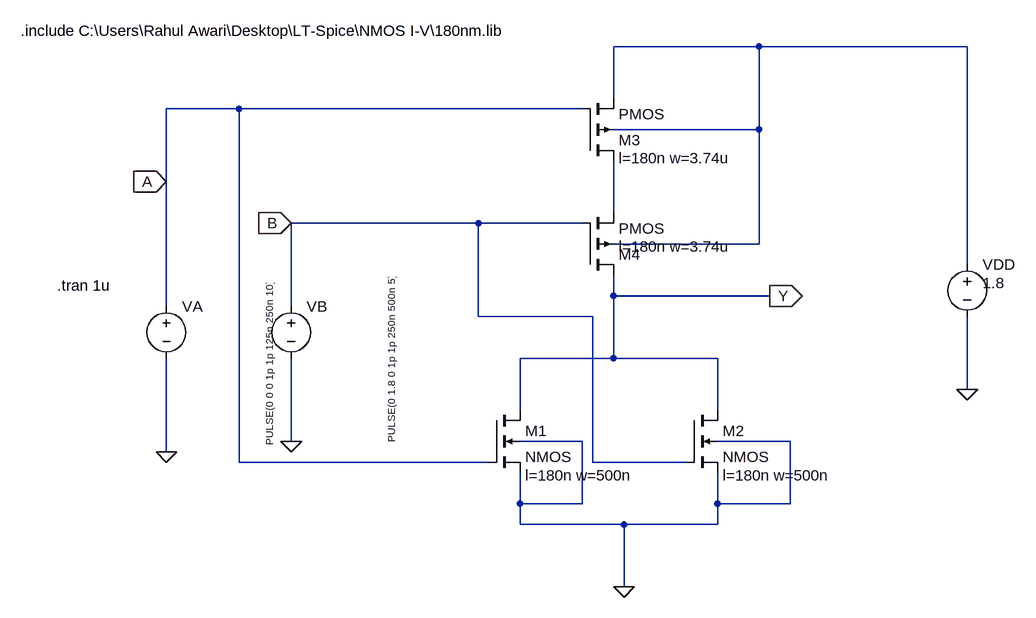
[diagram p0: schematic nor.asc]
nor.asc, the LTspice schematic file:
Version 4
SHEET 1 880 680
WIRE 464 -224 240 -224
WIRE 784 -224 464 -224
WIRE 240 -144 240 -224
WIRE -336 -128 -448 -128
WIRE 192 -128 -336 -128
WIRE 464 -96 464 -224
WIRE 464 -96 240 -96
WIRE -448 -16 -448 -128
WIRE 240 32 240 -48
WIRE 32 48 -256 48
WIRE 192 48 32 48
WIRE 464 80 464 -96
WIRE 464 80 240 80
WIRE 784 112 784 -224
WIRE 240 160 240 128
WIRE 480 160 240 160
WIRE -448 176 -448 -16
WIRE -256 176 -256 48
WIRE 32 192 32 48
WIRE 208 192 32 192
WIRE 240 256 240 160
WIRE 240 256 96 256
WIRE 400 256 240 256
WIRE 784 304 784 192
WIRE 96 336 96 256
WIRE 400 336 400 256
WIRE -256 384 -256 256
WIRE 192 384 96 384
WIRE 512 384 400 384
WIRE -448 400 -448 256
WIRE -336 416 -336 -128
WIRE 48 416 -336 416
WIRE 208 416 208 192
WIRE 352 416 208 416
WIRE 96 480 96 432
WIRE 192 480 192 384
WIRE 192 480 96 480
WIRE 400 480 400 432
WIRE 512 480 512 384
WIRE 512 480 400 480
WIRE 96 512 96 480
WIRE 256 512 96 512
WIRE 400 512 400 480
WIRE 400 512 256 512
WIRE 256 608 256 512
FLAG 784 304 0
FLAG 256 608 0
FLAG -256 384 0
FLAG -448 400 0
FLAG -448 -16 A
IOPIN -448 -16 In
FLAG -256 48 B
IOPIN -256 48 In
FLAG 480 160 Y
IOPIN 480 160 Out
SYMBOL nmos4 48 336 R0
WINDOW 123 56 100 Left 2
SYMATTR Value2 l=180n w=500n
SYMATTR InstName M1
SYMBOL nmos4 352 336 R0
WINDOW 123 56 100 Left 2
SYMATTR Value2 l=180n w=500n
SYMATTR InstName M2
SYMBOL voltage 784 96 R0
WINDOW 3 24 44 Left 2
WINDOW 123 0 0 Left 0
WINDOW 39 0 0 Left 0
SYMATTR Value 1.8
SYMATTR InstName VDD
SYMBOL voltage -448 160 R0
WINDOW 3 159 231 VLeft 1
WINDOW 123 0 0 Left 0
WINDOW 39 0 0 Left 0
SYMATTR Value PULSE(0 0 0 1p 1p 125n 250n 10)
SYMATTR InstName VA
SYMBOL voltage -256 160 R0
WINDOW 3 154 226 VLeft 1
WINDOW 123 0 0 Left 0
WINDOW 39 0 0 Left 0
SYMATTR Value PULSE(0 1.8 0 1p 1p 250n 500n 5)
SYMATTR InstName VB
SYMBOL pmos4 192 -48 M180
WINDOW 123 56 4 Left 2
SYMATTR Value2 l=180n w=3.74u
SYMATTR InstName M3
SYMBOL pmos4 192 128 M180
WINDOW 123 56 44 Left 2
SYMATTR Value2 l=180n w=3.74u
SYMATTR InstName M4
TEXT -672 -248 Left 2 !.include C:\\Users\\Rahul Awari\\Desktop\\LT-Spice\\NMOS I-V\\180nm.lib
TEXT -616 144 Left 2 !.tran 1u

The netlist it stands for:
* nor.asc
M1 Y A 0 0 NMOS l=180n w=500n
M2 Y B 0 0 NMOS l=180n w=500n
VDD N001 0 1.8
VA A 0 PULSE(0 0 0 1p 1p 125n 250n 10)
VB B 0 PULSE(0 1.8 0 1p 1p 250n 500n 5)
M3 N002 A N001 N001 PMOS l=180n w=3.74u
M4 Y B N002 N001 PMOS l=180n w=3.74u
.model NMOS NMOS
.model PMOS PMOS
.lib standard.mos
.include C:\Users\Rahul Awari\Desktop\LT-Spice\NMOS I-V\180nm.lib
.tran 1u
.backanno
.end